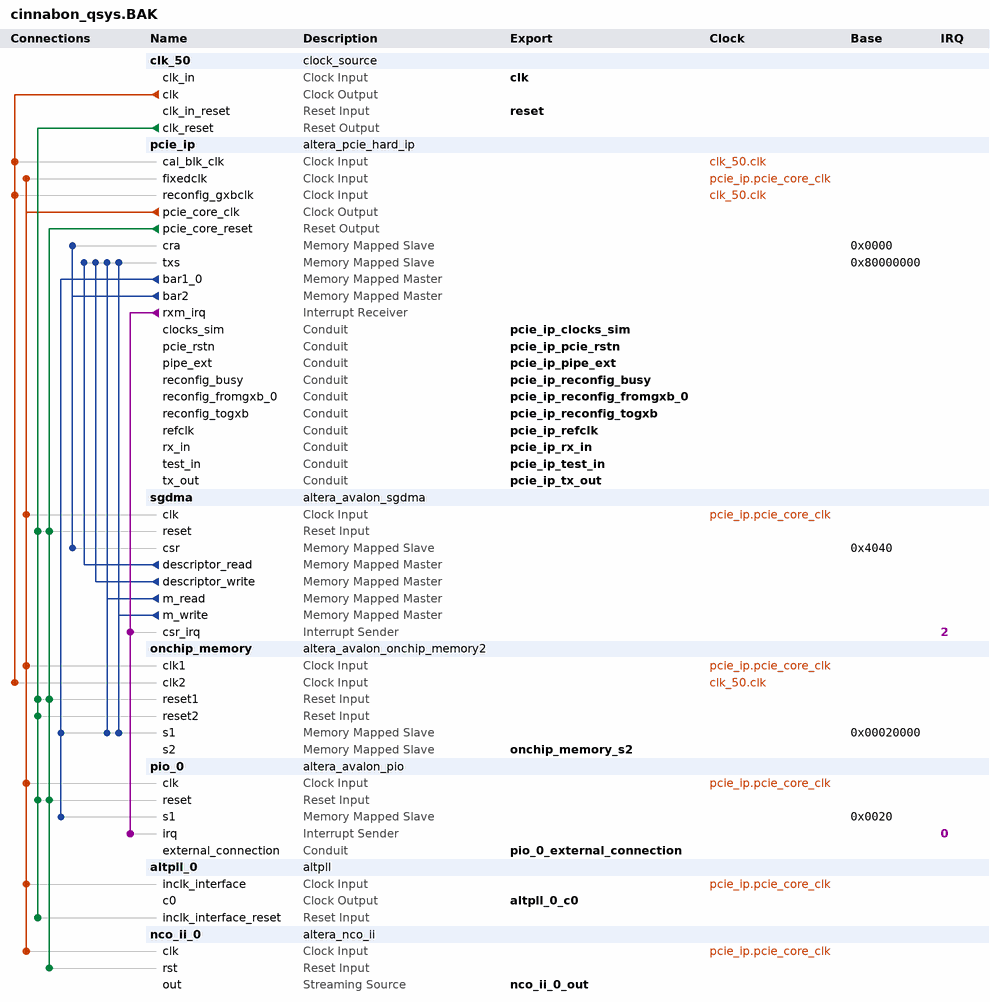
[diagram p0: system contents]
# Platform Designer (Qsys) system cinnabon_qsys.BAK, Cyclone IV GX EP4CGX150DF31C7
# Parameters at their usual value, and those the tool derives, are not listed.
package require -exact qsys 16.1
create_system cinnabon_qsys.BAK
set_project_property DEVICE_FAMILY {Cyclone IV GX}
set_project_property DEVICE EP4CGX150DF31C7

add_instance clk_50 clock_source 16.1
set_instance_parameter_value clk_50 clockFrequency 50000000

add_instance pcie_ip altera_pcie_hard_ip 16.1
set_instance_parameter_value pcie_ip {BAR Type} {64 bit Prefetchable,Not used,32 bit Non-Prefetchable,Not used,Not used,Not used}
set_instance_parameter_value pcie_ip CB_A2P_ADDR_MAP_PASS_THRU_BITS 31
set_instance_parameter_value pcie_ip CG_ENABLE_A2P_INTERRUPT 0
set_instance_parameter_value pcie_ip CG_NO_CPL_REORDERING 0
set_instance_parameter_value pcie_ip {PCIe Address 31:0} 0x00000000,0x00000000,0x00000000,0x00000000,0x00000000,0x00000000,0x00000000,0x00000000,0x00000000,0x00000000,0x00000000,0x00000000,0x00000000,0x00000000,0x00000000,0x00000000
set_instance_parameter_value pcie_ip {PCIe Address 63:32} 0x00000000,0x00000000,0x00000000,0x00000000,0x00000000,0x00000000,0x00000000,0x00000000,0x00000000,0x00000000,0x00000000,0x00000000,0x00000000,0x00000000,0x00000000,0x00000000
set_instance_parameter_value pcie_ip class_code 0
set_instance_parameter_value pcie_ip device_id 57345
set_instance_parameter_value pcie_ip my_advanced_errors false
set_instance_parameter_value pcie_ip my_enable_ecrc_check false
set_instance_parameter_value pcie_ip my_enable_ecrc_gen false
set_instance_parameter_value pcie_ip p_pcie_test_out_width None
set_instance_parameter_value pcie_ip p_user_msi_enable 0
set_instance_parameter_value pcie_ip subsystem_device_id 4
set_instance_parameter_value pcie_ip subsystem_vendor_id 4466
set_instance_parameter_value pcie_ip vendor_id 4466

add_instance sgdma altera_avalon_sgdma 16.1
set_instance_parameter_value sgdma enableBurstTransfers false
set_instance_parameter_value sgdma enableUnalignedTransfers false
set_instance_parameter_value sgdma readBlockDataWidth 64
set_instance_parameter_value sgdma sinkErrorWidth 0
set_instance_parameter_value sgdma sourceErrorWidth 0
set_instance_parameter_value sgdma transferMode MEMORY_TO_MEMORY
set_instance_parameter_value sgdma writeBurstcountWidth 4

add_instance onchip_memory altera_avalon_onchip_memory2 16.1
set_instance_parameter_value onchip_memory dataWidth 64
set_instance_parameter_value onchip_memory dualPort true
set_instance_parameter_value onchip_memory initMemContent true
set_instance_parameter_value onchip_memory initializationFileName onchip_memory
set_instance_parameter_value onchip_memory memorySize 131072

add_instance pio_0 altera_avalon_pio 16.1
set_instance_parameter_value pio_0 direction Input
set_instance_parameter_value pio_0 generateIRQ true
set_instance_parameter_value pio_0 width 16

add_instance altpll_0 altpll 16.1
set_instance_parameter_value altpll_0 CLK0_DIVIDE_BY 2
set_instance_parameter_value altpll_0 CLK0_MULTIPLY_BY 5
set_instance_parameter_value altpll_0 INCLK0_INPUT_FREQUENCY 20000
set_instance_parameter_value altpll_0 PORT_ARESET PORT_UNUSED
set_instance_parameter_value altpll_0 PORT_LOCKED PORT_UNUSED
set_instance_parameter_value altpll_0 PORT_clk1 PORT_UNUSED
set_instance_parameter_value altpll_0 PORT_clk2 PORT_UNUSED
set_instance_parameter_value altpll_0 PORT_clk3 PORT_UNUSED

add_instance nco_ii_0 altera_nco_ii 16.1
set_instance_parameter_value nco_ii_0 apr 32
set_instance_parameter_value nco_ii_0 apri 16
set_instance_parameter_value nco_ii_0 arch large_rom
set_instance_parameter_value nco_ii_0 freq_out 1.0
set_instance_parameter_value nco_ii_0 fsamp 50.0
set_instance_parameter_value nco_ii_0 mpr 18
set_instance_parameter_value nco_ii_0 selected_device_family {Cyclone IV GX}
set_instance_parameter_value nco_ii_0 want_freq_mod true
set_instance_parameter_value nco_ii_0 want_phase_mod true
set_instance_parameter_value nco_ii_0 want_sin_and_cos single_output

# connections
add_connection clk_50.clk onchip_memory.clk2 clock
add_connection clk_50.clk pcie_ip.cal_blk_clk clock
add_connection clk_50.clk pcie_ip.reconfig_gxbclk clock
add_connection pcie_ip.pcie_core_clk altpll_0.inclk_interface clock
add_connection pcie_ip.pcie_core_clk nco_ii_0.clk clock
add_connection pcie_ip.pcie_core_clk onchip_memory.clk1 clock
add_connection pcie_ip.pcie_core_clk pcie_ip.fixedclk clock
add_connection pcie_ip.pcie_core_clk pio_0.clk clock
add_connection pcie_ip.pcie_core_clk sgdma.clk clock
add_connection clk_50.clk_reset altpll_0.inclk_interface_reset reset
add_connection clk_50.clk_reset onchip_memory.reset1 reset
add_connection clk_50.clk_reset onchip_memory.reset2 reset
add_connection clk_50.clk_reset pio_0.reset reset
add_connection clk_50.clk_reset sgdma.reset reset
add_connection pcie_ip.pcie_core_reset nco_ii_0.rst reset
add_connection pcie_ip.pcie_core_reset onchip_memory.reset1 reset
add_connection pcie_ip.pcie_core_reset pio_0.reset reset
add_connection pcie_ip.pcie_core_reset sgdma.reset reset
add_connection pcie_ip.bar1_0 onchip_memory.s1 avalon
set_connection_parameter_value pcie_ip.bar1_0/onchip_memory.s1 baseAddress 0x00020000
add_connection pcie_ip.bar1_0 pio_0.s1 avalon
set_connection_parameter_value pcie_ip.bar1_0/pio_0.s1 baseAddress 0x0020
add_connection pcie_ip.bar2 pcie_ip.cra avalon
set_connection_parameter_value pcie_ip.bar2/pcie_ip.cra baseAddress 0x0000
add_connection pcie_ip.bar2 sgdma.csr avalon
set_connection_parameter_value pcie_ip.bar2/sgdma.csr baseAddress 0x4040
add_connection sgdma.descriptor_read pcie_ip.txs avalon
set_connection_parameter_value sgdma.descriptor_read/pcie_ip.txs baseAddress 0x80000000
add_connection sgdma.descriptor_write pcie_ip.txs avalon
set_connection_parameter_value sgdma.descriptor_write/pcie_ip.txs baseAddress 0x80000000
add_connection sgdma.m_read onchip_memory.s1 avalon
set_connection_parameter_value sgdma.m_read/onchip_memory.s1 baseAddress 0x00020000
add_connection sgdma.m_read pcie_ip.txs avalon
set_connection_parameter_value sgdma.m_read/pcie_ip.txs baseAddress 0x80000000
add_connection sgdma.m_write onchip_memory.s1 avalon
set_connection_parameter_value sgdma.m_write/onchip_memory.s1 baseAddress 0x00020000
add_connection sgdma.m_write pcie_ip.txs avalon
set_connection_parameter_value sgdma.m_write/pcie_ip.txs baseAddress 0x80000000
add_connection pcie_ip.rxm_irq pio_0.irq interrupt
set_connection_parameter_value pcie_ip.rxm_irq/pio_0.irq irqNumber 0
add_connection pcie_ip.rxm_irq sgdma.csr_irq interrupt
set_connection_parameter_value pcie_ip.rxm_irq/sgdma.csr_irq irqNumber 2

# exported interfaces
add_interface altpll_0_c0 clock source
set_interface_property altpll_0_c0 EXPORT_OF altpll_0.c0
add_interface clk clock sink
set_interface_property clk EXPORT_OF clk_50.clk_in
add_interface nco_ii_0_out avalon_streaming source
set_interface_property nco_ii_0_out EXPORT_OF nco_ii_0.out
add_interface onchip_memory_s2 avalon slave
set_interface_property onchip_memory_s2 EXPORT_OF onchip_memory.s2
add_interface pcie_ip_clocks_sim conduit end
set_interface_property pcie_ip_clocks_sim EXPORT_OF pcie_ip.clocks_sim
add_interface pcie_ip_pcie_rstn conduit end
set_interface_property pcie_ip_pcie_rstn EXPORT_OF pcie_ip.pcie_rstn
add_interface pcie_ip_pipe_ext conduit end
set_interface_property pcie_ip_pipe_ext EXPORT_OF pcie_ip.pipe_ext
add_interface pcie_ip_reconfig_busy conduit end
set_interface_property pcie_ip_reconfig_busy EXPORT_OF pcie_ip.reconfig_busy
add_interface pcie_ip_reconfig_fromgxb_0 conduit end
set_interface_property pcie_ip_reconfig_fromgxb_0 EXPORT_OF pcie_ip.reconfig_fromgxb_0
add_interface pcie_ip_reconfig_togxb conduit end
set_interface_property pcie_ip_reconfig_togxb EXPORT_OF pcie_ip.reconfig_togxb
add_interface pcie_ip_refclk conduit end
set_interface_property pcie_ip_refclk EXPORT_OF pcie_ip.refclk
add_interface pcie_ip_rx_in conduit end
set_interface_property pcie_ip_rx_in EXPORT_OF pcie_ip.rx_in
add_interface pcie_ip_test_in conduit end
set_interface_property pcie_ip_test_in EXPORT_OF pcie_ip.test_in
add_interface pcie_ip_tx_out conduit end
set_interface_property pcie_ip_tx_out EXPORT_OF pcie_ip.tx_out
add_interface pio_0_external_connection conduit end
set_interface_property pio_0_external_connection EXPORT_OF pio_0.external_connection
add_interface reset reset sink
set_interface_property reset EXPORT_OF clk_50.clk_in_reset

set_interconnect_requirement {$system} qsys_mm.clockCrossingAdapter HANDSHAKE
set_interconnect_requirement {$system} qsys_mm.maxAdditionalLatency 1

save_system cinnabon_qsys.BAK.qsys
